# EAGLE design shemLamps (EAGLE 9.6.2)
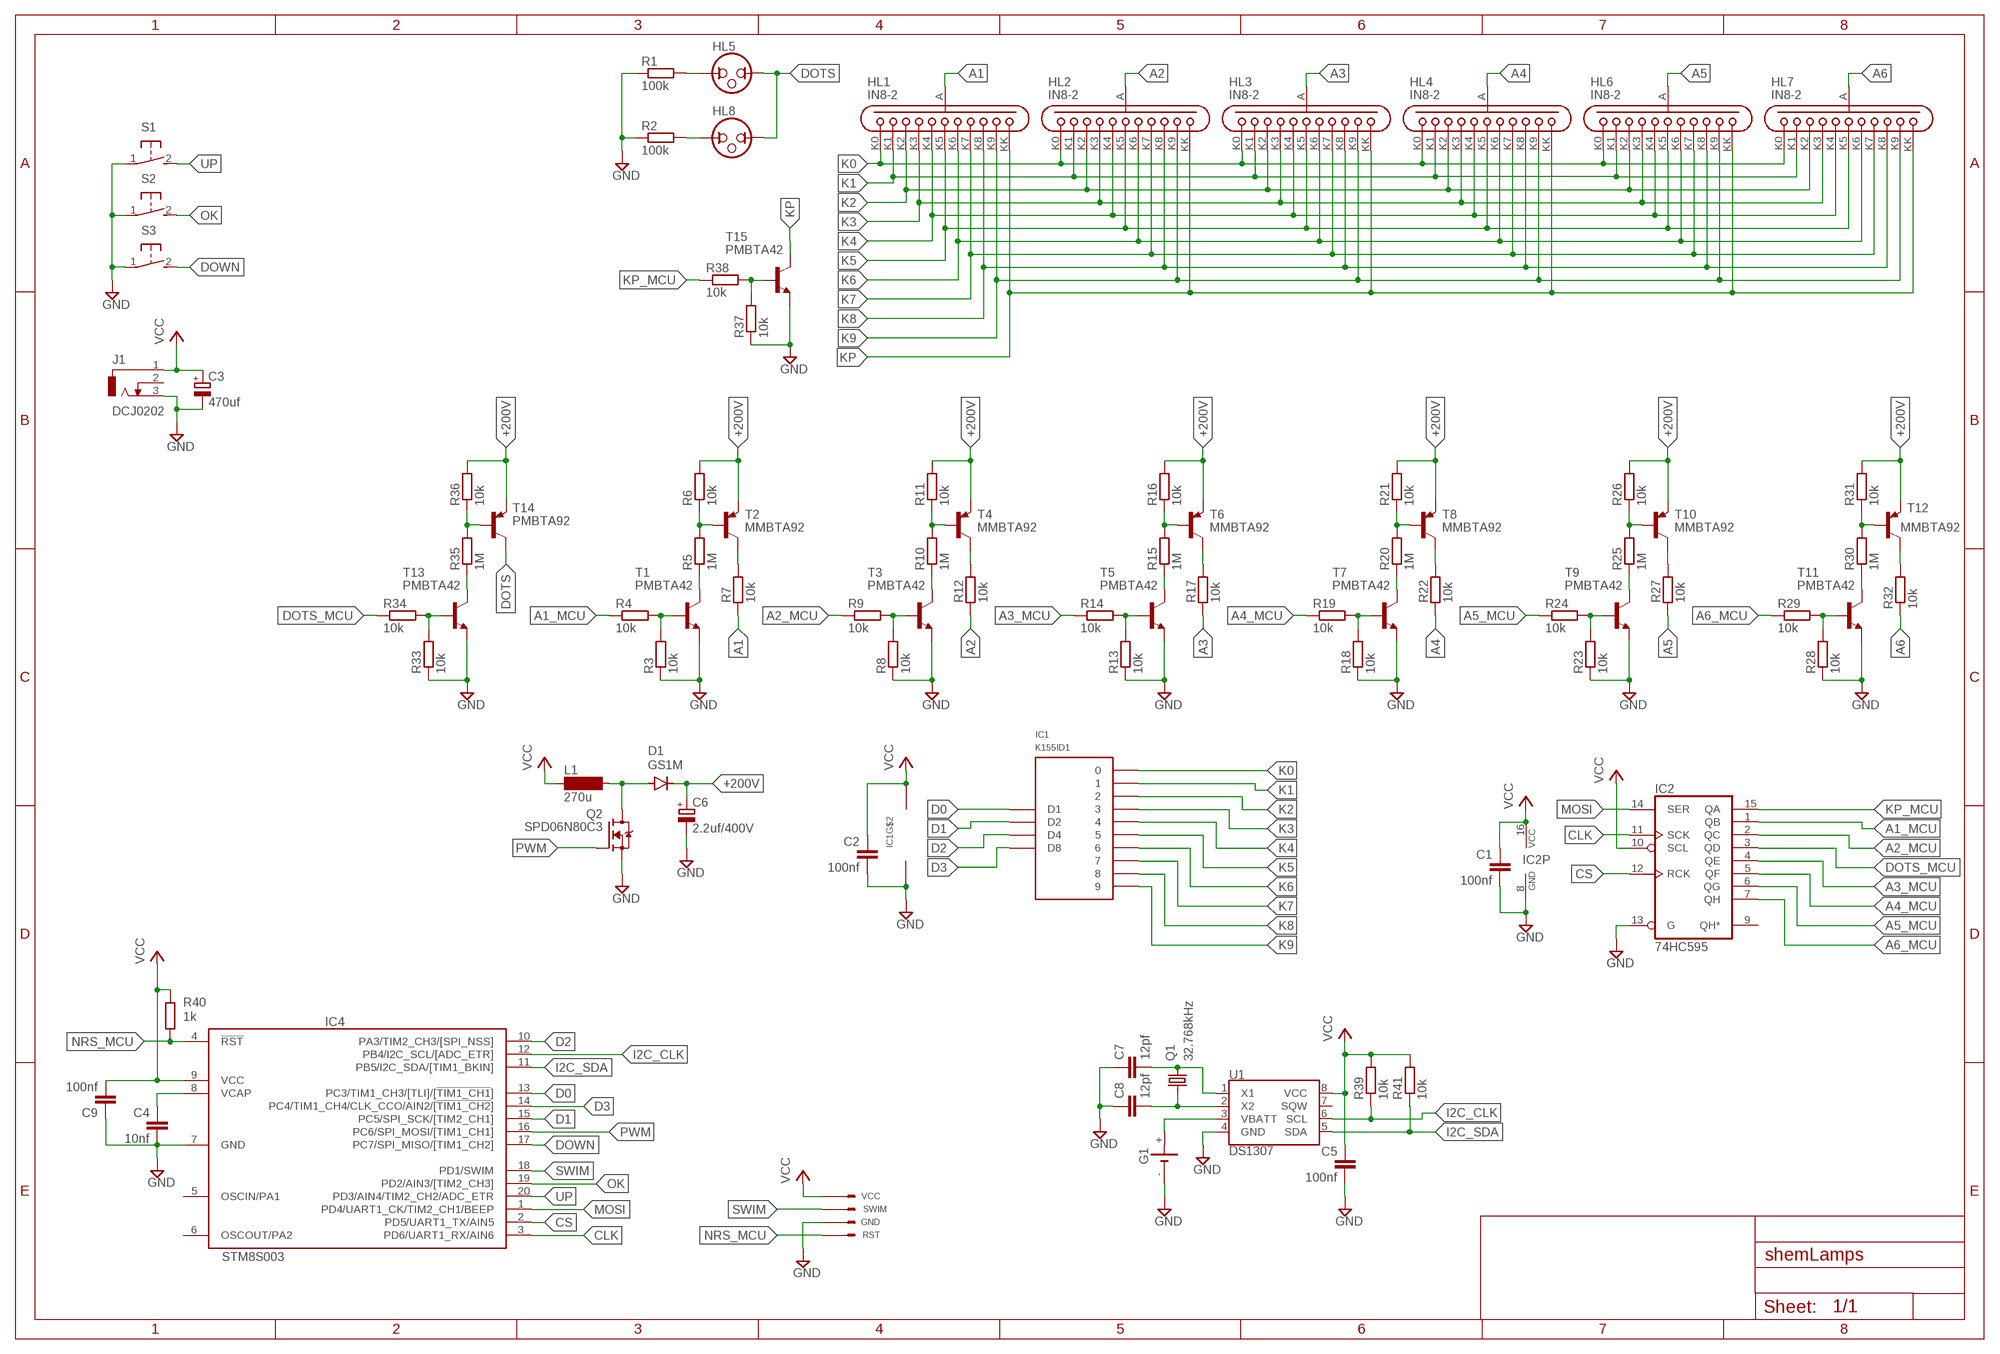
[diagram p0: schematic, sheet 1]

## Parts
C1  100nf  CAP  [C0805]
C2  100nf  CAP  [C0805]
C3  470uf  CPOL-EUE3.5-8  [E3,5-8]
C4  10nf  CAP  [C0805]
C5  100nf  CAP  [C0805]
C6  2.2uf/400V  CPOL-EUE3.5-8  [E3,5-8]
C7  12pf  CAP  [C0805]
C8  12pf  CAP  [C0805]
C9  100nf  CAP  [C0805]
D1  GS1M  DIODE-DO-214AC  [DO-214AC]
G1  BATTERY  [CH291-1220LF_W]
HL1  IN8-2  [IN8-2]
HL2  IN8-2  [IN8-2]
HL3  IN8-2  [IN8-2]
HL4  IN8-2  [IN8-2]
HL5  NEON_LAMP  [NEON_LAMP]
HL6  IN8-2  [IN8-2]
HL7  IN8-2  [IN8-2]
HL8  NEON_LAMP  [NEON_LAMP]
IC1  K155ID1  [DIL16]
IC2  74HC595  [TSSOP16L]
IC4  STM8S003  [TSSOP-20]
J1  DCJ0202  [DCJ0202]
L1  270u  BS11  [BS11]
Q1  32.768kHz  CRYSTALTC26H  [TC26H]
Q2  SPD06N80C3  [TO252]
R1  100k  R-EU_0207/10  [0207/10]
R2  100k  R-EU_0207/10  [0207/10]
R3  10k  RES  [R0805]
R4  10k  RES  [R0805]
R5  1M  RES  [R0805]
R6  10k  RES  [R0805]
R7  10k  RES  [R0805]
R8  10k  RES  [R0805]
R9  10k  RES  [R0805]
R10  1M  RES  [R0805]
R11  10k  RES  [R0805]
R12  10k  RES  [R0805]
R13  10k  RES  [R0805]
R14  10k  RES  [R0805]
R15  1M  RES  [R0805]
R16  10k  RES  [R0805]
R17  10k  RES  [R0805]
R18  10k  RES  [R0805]
R19  10k  RES  [R0805]
R20  1M  RES  [R0805]
R21  10k  RES  [R0805]
R22  10k  RES  [R0805]
R23  10k  RES  [R0805]
R24  10k  RES  [R0805]
R25  1M  RES  [R0805]
R26  10k  RES  [R0805]
R27  10k  RES  [R0805]
R28  10k  RES  [R0805]
R29  10k  RES  [R0805]
R30  1M  RES  [R0805]
R31  10k  RES  [R0805]
R32  10k  RES  [R0805]
R33  10k  RES  [R0805]
R34  10k  RES  [R0805]
R35  1M  RES  [R0805]
R36  10k  RES  [R0805]
R37  10k  RES  [R0805]
R38  10k  RES  [R0805]
R39  10k  RES  [R0805]
R40  1k  RES  [R0805]
R41  10k  RES  [R0805]
S1  31-XX  [B3F-31XX]
S2  31-XX  [B3F-31XX]
S3  31-XX  [B3F-31XX]
SV1  SWIM  [SWIM]
T1  PMBTA42  BC817-16-NPN-SOT23-BEC  [SOT23-BEC]
T2  MMBTA92  BC807-16-PNP-SOT23-BEC  [SOT23-BEC]
T3  PMBTA42  BC817-16-NPN-SOT23-BEC  [SOT23-BEC]
T4  MMBTA92  BC807-16-PNP-SOT23-BEC  [SOT23-BEC]
T5  PMBTA42  BC817-16-NPN-SOT23-BEC  [SOT23-BEC]
T6  MMBTA92  BC807-16-PNP-SOT23-BEC  [SOT23-BEC]
T7  PMBTA42  BC817-16-NPN-SOT23-BEC  [SOT23-BEC]
T8  MMBTA92  BC807-16-PNP-SOT23-BEC  [SOT23-BEC]
T9  PMBTA42  BC817-16-NPN-SOT23-BEC  [SOT23-BEC]
T10  MMBTA92  BC807-16-PNP-SOT23-BEC  [SOT23-BEC]
T11  PMBTA42  BC817-16-NPN-SOT23-BEC  [SOT23-BEC]
T12  MMBTA92  BC807-16-PNP-SOT23-BEC  [SOT23-BEC]
T13  PMBTA42  BC817-16-NPN-SOT23-BEC  [SOT23-BEC]
T14  PMBTA92  BC807-16-PNP-SOT23-BEC  [SOT23-BEC]
T15  PMBTA42  BC817-16-NPN-SOT23-BEC  [SOT23-BEC]
U1  DS1307  [SO08]

## Nets
+200V: C6.+ D1.C R6.2 R11.2 R16.2 R21.2 R26.2 R31.2 R36.2 T2.E T4.E T6.E T8.E T10.E T12.E T14.E
A1: HL1.A R7.1
A1_MCU: IC2.1(QB) R4.1
A2: HL2.A R12.1
A2_MCU: IC2.2(QC) R9.1
A3: HL3.A R17.1
A3_MCU: IC2.4(QE) R14.1
A4: HL4.A R22.1
A4_MCU: IC2.5(QF) R19.1
A5: HL6.A R27.1
A5_MCU: IC2.6(QG) R24.1
A6: HL7.A R32.1
A6_MCU: IC2.7(QH) R29.1
CLK: IC2.11(SCK) IC4.3(PD6/UART1_RX/AIN6)
CS: IC2.12(RCK) IC4.2(PD5/UART1_TX/AIN5)
D0: IC1.3(D1) IC4.13(PC3/TIM1_CH3/[TLI]/[!TIM1_CH1!])
D1: IC1.6(D2) IC4.15(PC5/SPI_SCK/[TIM2_CH1])
D2: IC1.7(D4) IC4.10(PA3/TIM2_CH3/[SPI_NSS])
D3: IC1.4(D8) IC4.14(PC4/TIM1_CH4/CLK_CCO/AIN2/[!TIM1_CH2!])
DOTS: HL5.2 HL8.2 T14.C
DOTS_MCU: IC2.3(QD) R34.1
DOWN: IC4.17(PC7/SPI_MISO/[TIM1_CH2]) S3.2(S)
GND: C1.2 C2.2 C3.- C4.2 C5.2 C6.- C7.1 C8.1 C9.1 G1.- IC1.12(GND) IC2.8(GND) IC2.13(G) IC4.7(GND) J1.3 Q2.2(S) R1.1 R2.1 R3.1 R8.1 R13.1 R18.1 R23.1 R28.1 R33.1 R37.1 S1.1(P) S2.1(P) S3.1(P) SV1.GND T1.E T3.E T5.E T7.E T9.E T11.E T13.E T15.E U1.4(GND)
I2C_CLK: IC4.12(PB4/I2C_SCL/[ADC_ETR]) R39.1 U1.6(SCL)
I2C_SDA: IC4.11(PB5/I2C_SDA/[TIM1_BKIN]) R41.1 U1.5(SDA)
K0: HL1.K0 HL2.K0 HL3.K0 HL4.K0 HL6.K0 HL7.K0 IC1.16
K1: HL1.K1 HL2.K1 HL3.K1 HL4.K1 HL6.K1 HL7.K1 IC1.15
K2: HL1.K2 HL2.K2 HL3.K2 HL4.K2 HL6.K2 HL7.K2 IC1.8
K3: HL1.K3 HL2.K3 HL3.K3 HL4.K3 HL6.K3 HL7.K3 IC1.9
K4: HL1.K4 HL2.K4 HL3.K4 HL4.K4 HL6.K4 HL7.K4 IC1.13
K5: HL1.K5 HL2.K5 HL3.K5 HL4.K5 HL6.K5 HL7.K5 IC1.14
K6: HL1.K6 HL2.K6 HL3.K6 HL4.K6 HL6.K6 HL7.K6 IC1.11
K7: HL1.K7 HL2.K7 HL3.K7 HL4.K7 HL6.K7 HL7.K7 IC1.10
K8: HL1.K8 HL2.K8 HL3.K8 HL4.K8 HL6.K8 HL7.K8 IC1.1
K9: HL1.K9 HL2.K9 HL3.K9 HL4.K9 HL6.K9 HL7.K9 IC1.2
KP: HL1.KK HL2.KK HL3.KK HL4.KK HL6.KK HL7.KK T15.C
KP_MCU: IC2.15(QA) R38.1
MOSI: IC2.14(SER) IC4.1(PD4/UART1_CK/TIM2_CH1/BEEP)
N$1: HL5.1 R1.2
N$2: HL8.1 R2.2
N$3: R3.2 R4.2 T1.B
N$4: R8.2 R9.2 T3.B
N$5: R5.1 T1.C
N$6: R5.2 R6.1 T2.B
N$7: R10.1 T3.C
N$8: R7.2 T2.C
N$9: R10.2 R11.1 T4.B
N$10: R12.2 T4.C
N$11: R13.2 R14.2 T5.B
N$12: R15.1 T5.C
N$13: R15.2 R16.1 T6.B
N$14: R17.2 T6.C
N$15: R18.2 R19.2 T7.B
N$16: R20.1 T7.C
N$17: R20.2 R21.1 T8.B
N$18: R22.2 T8.C
N$19: R23.2 R24.2 T9.B
N$20: R25.1 T9.C
N$21: R25.2 R26.1 T10.B
N$22: R27.2 T10.C
N$23: R28.2 R29.2 T11.B
N$24: R30.1 T11.C
N$25: R30.2 R31.1 T12.B
N$26: R32.2 T12.C
N$27: R37.2 R38.2 T15.B
N$28: D1.A L1.2 Q2.3(D)
N$30: C4.1 IC4.8(VCAP)
N$31: G1.+ U1.3(VBATT)
N$32: C8.2 Q1.2 U1.2(X2)
N$33: R33.2 R34.2 T13.B
N$34: R35.1 T13.C
N$35: R35.2 R36.1 T14.B
N$36: C7.2 Q1.1 U1.1(X1)
NRS_MCU: IC4.4(!RST) R40.1 SV1.NRS(RST)
OK: IC4.19(PD2/AIN3/[TIM2_CH3]) S2.2(S)
PWM: IC4.16(PC6/SPI_MOSI/[TIM1_CH1]) Q2.1(G)
SWIM: IC4.18(PD1/SWIM) SV1.SWIM
UP: IC4.20(PD3/AIN4/TIM2_CH2/ADC_ETR) S1.2(S)
VCC: C1.1 C2.1 C3.+ C5.1 C9.2 IC1.5(VCC) IC2.10(SCL) IC2.16(VCC) IC4.9(VCC) J1.1 L1.1 R39.2 R40.2 R41.2 SV1.VCC U1.8(VCC)
Unconnected: IC2.9(QH*) IC4.5(OSCIN/PA1) IC4.6(OSCOUT/PA2) J1.2 U1.7(SQW)

## Library data of the parts
C1 C2 C4 C5 C7-C9 = myRlc:CAP
C3 C6 = rcl:CPOL-EU: POLARIZED CAPACITOR, European symbol; SPICEPREFIX: C
D1 = diode:DIODE-: DIODE
G1 = clock_7seg_0.8inch:BATTERY
HL1-HL4 HL6 HL7 = LAMPS:IN8-2
HL5 HL8 = LAMPS:NEON_LAMP
IC1 = LAMPS:K155ID1
IC2 = inter:74HC595
IC4 = inter:STM8S003: Value line, 16 MHz STM8S 8-bit MCU, 8 Kbytes Flash, 128 bytes data EEPROM, 10-bit ADC, 3 timers, UART, SPI, I2C
J1 = con-jack:DCJ0202: DC POWER JACK Source: DCJ0202.pdf; OC_FARNELL: unknown; OC_NEWARK: unknown
L1 = inductor-neosid:BS: INDUCTOR nominal inductance, magnetically screened; OC_FARNELL: unknown; OC_NEWARK: unknown
Q1 = crystal:CRYSTAL: CRYSTAL; OC_FARNELL: unknown; OC_NEWARK: unknown
Q2 = inter:SPD06N80C3
R1 R2 = rcl:R-EU_: RESISTOR, European symbol; SPICEPREFIX: R
R3-R41 = myRlc:RES
S1-S3 = switch-omron:31-XX: OMRON SWITCH; MPN: B3F-3100; OC_FARNELL: 959704; OC_NEWARK: 36M3582
SV1 = inter:SWIM
T1 T3 T5 T7 T9 T11 T13 T15 = transistor:*-NPN-: NPN Transistror BF959 corrected 2008.03.06
T2 T4 T6 T8 T10 T12 T14 = transistor:*-PNP-: PNP Transistror
U1 = inter:DS1307: Maxim DS1307 - I2C Real-time clock (RTC) The DS1307 serial real-time clock (RTC) is a low-power, full binary-coded decimal (BCD) clock/calendar plus 56 bytes of NV SRAM. Address and data are transferred serially through an I2C, bidirectional bus. The clock/calendar provides seconds, minutes, hours, day, date, month, and year information. SparkFun Products: Real Time Clock Module <https://www.sparkfun.com/products/12708> (BOB-12708) Datasheet <https://cdn.sparkfun.com/datasheets/BreakoutBoards/DS1307.pdf>

## Board
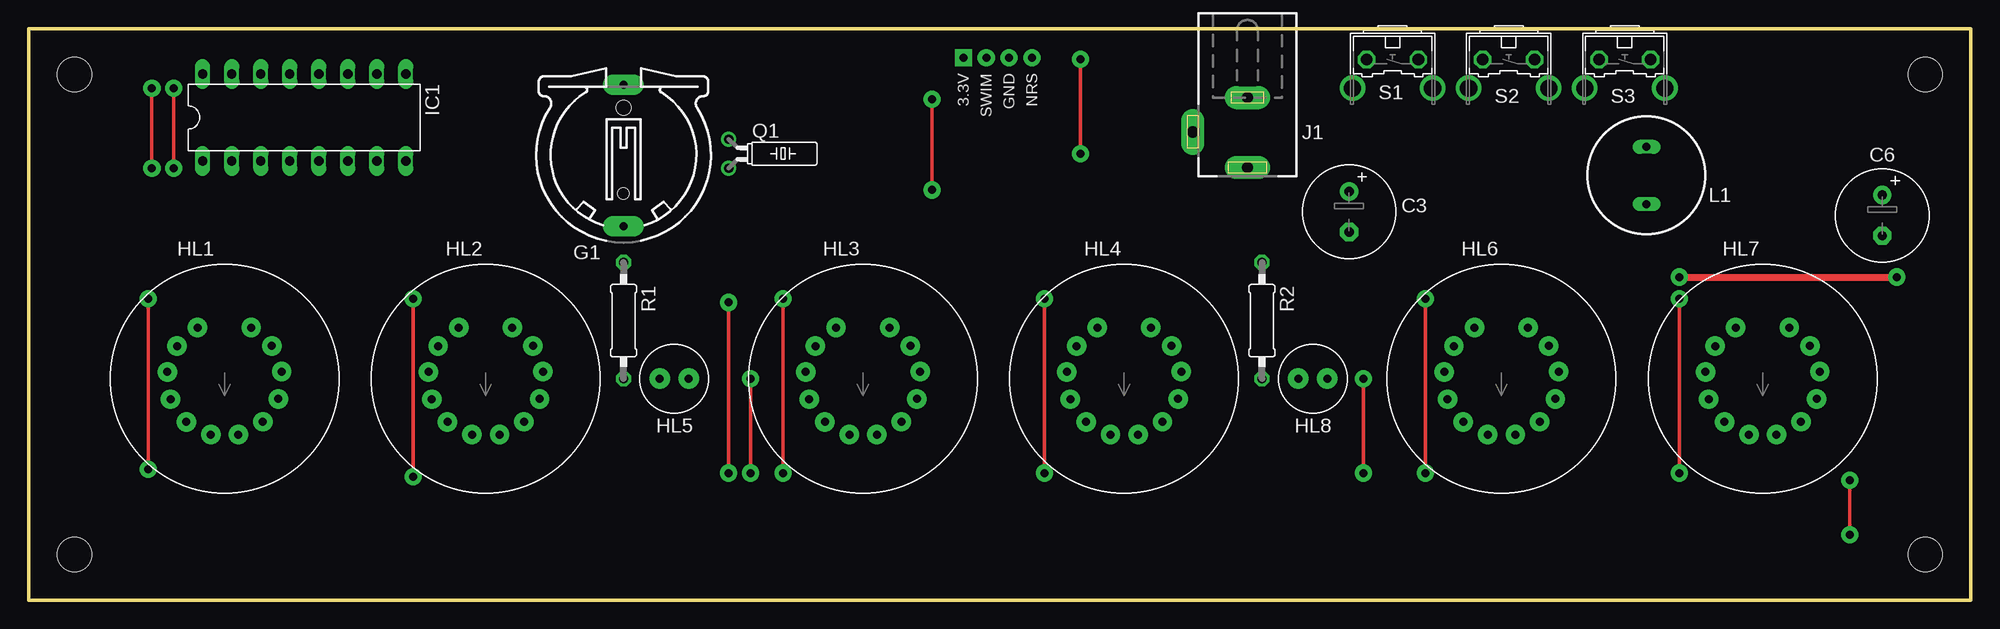
[diagram p1: board, top side]
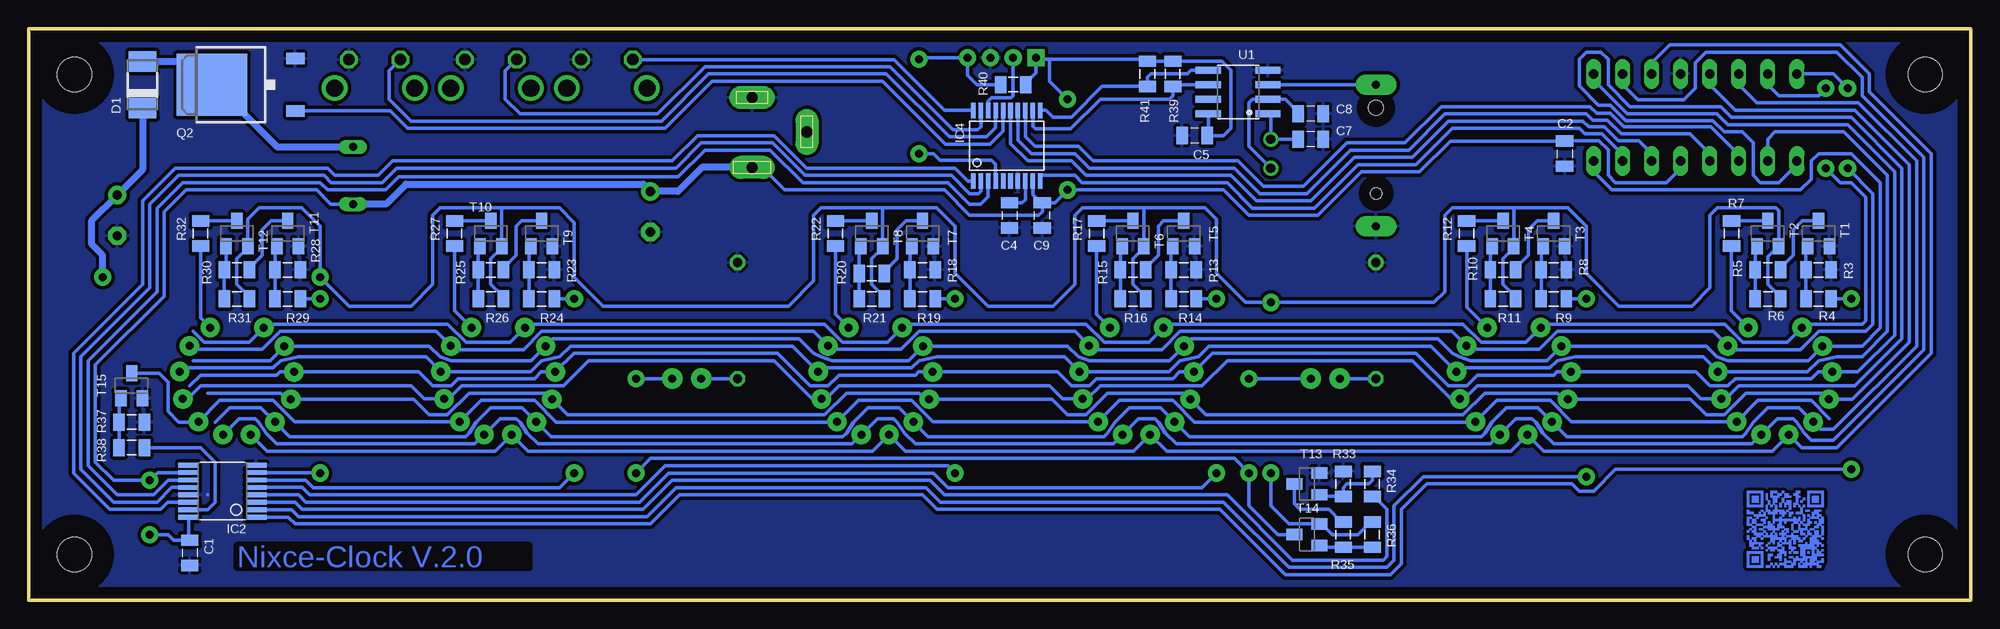
[diagram p2: board, bottom side, seen from below]

Size 170 x 50 mm. Coordinates in mm from the lower left corner, seen from the top.
Outline: 0,0 0,50 170,50 170,0 0,0
Copper layers (1*16): Top 0.035mm / dielectric 1.5mm / Bottom 0.035mm
Design rules "default *": minimum track width 0.3mm, minimum drill 0.7mm, track to track 0.1mm, track to pad 0.1mm, pad to pad 0.1mm, via to via 6mil, smd to smd 6mil, copper to edge 40mil, drill to drill 6mil, minimum pad ring 10mil, minimum via ring 0.4mm, stop-mask expansion 4mil, vias tented up to drill 0mil, thermal gap 10mil
Holes 3 mm at 4,4 4,46 166,4 166,46
bRestrict: area 1,43 to 7,49; area 1,1 to 7,7; area 163,1 to 169,7; area 163,43 to 169,49

### Footprints (pad centres in the part's own frame; a part is rotated, then mirrored left to right if it is on the bottom)
C0805 = smd 1 x 1.5: 1 -1.102,0; 2 1.102,0
E3,5-8 = drill 0.813 pad 1.6: + -1.778,0 | drill 0.813 pad 1.6 octagon: - 1.778,0
DO-214AC = smd 1.8 x 2.4: A 2.025,0; C -2.025,0
CH291-1220LF_W = drill 0.7 pad 1.8 long: + 0,0; - 0,12.383 | hole 1.3: 0,2 | hole 1: 0,9.5
IN8-2 = drill 0.7 pad 1.7: A 2.337,4.47; K0 4.147,2.874; K1 -2.354,4.459; K2 -4.156,2.853; K3 -5.006,0.594; K4 -4.709,-1.802; K5 -3.333,-3.785; K6 -1.192,-4.902; K7 1.222,-4.896; K8 4.723,-1.779; K9 5.009,0.618; KK 3.357,-3.769
NEON_LAMP = drill 0.7 pad 1.8: 1 -1.27,0; 2 1.27,0
DIL16 = drill 0.813 long: 1 -8.89,-3.81; 2 -6.35,-3.81; 3 -3.81,-3.81; 4 -1.27,-3.81; 5 1.27,-3.81; 6 3.81,-3.81; 7 6.35,-3.81; 8 8.89,-3.81; 9 8.89,3.81; 10 6.35,3.81; 11 3.81,3.81; 12 1.27,3.81; 13 -1.27,3.81; 14 -3.81,3.81; 15 -6.35,3.81; 16 -8.89,3.81
TSSOP16L = smd 0.42 x 1.78: 1 -2.275,-2.97; 2 -1.625,-2.97; 3 -0.975,-2.97; 4 -0.325,-2.97; 5 0.325,-2.97; 6 0.975,-2.97; 7 1.625,-2.97; 8 2.275,-2.97; 9 2.275,2.97; 10 1.625,2.97; 11 0.975,2.97; 12 0.325,2.97; 13 -0.325,2.97; 14 -0.975,2.97; 15 -1.625,2.97; 16 -2.275,2.97
TSSOP-20 = smd 0.4 x 1.35: 1 -2.54,-3.04; 2 -1.89,-3.04; 3 -1.24,-3.04; 4 -0.59,-3.04; 5 0.06,-3.04; 6 0.71,-3.04; 7 1.36,-3.04; 8 2.01,-3.04; 9 2.66,-3.04; 10 3.31,-3.04; 11 3.31,3.16; 12 2.66,3.16; 13 2.01,3.16; 14 1.36,3.16; 15 0.71,3.16; 16 0.06,3.16; 17 -0.59,3.16; 18 -1.24,3.16; 19 -1.89,3.16; 20 -2.54,3.16
DCJ0202 = drill 1 pad 2 long: 1 0,3.1; 2 4.8,0; 3 0,-3
BS11 = drill 0.7 long: 1 -2.5,0; 2 2.5,0
TC26H = drill 0.813: 1 -1.27,0; 2 1.27,0
TO252 = smd 1 x 1.6: 1 -2.28,-4.8; 2 2.28,-4.8 | smd 5.4 x 6.2: 3 0,2.5
0207/10 = drill 0.813 octagon: 1 -5.08,0; 2 5.08,0
R0805 = smd 1 x 1.5: 1 -1.102,0; 2 1.102,0
B3F-31XX = drill 1.016 octagon: 1 -2.261,-1.245; 2 2.261,-1.245 | drill 1.499 pad 2.159: 3 -3.505,1.245; 4 3.505,1.245
SWIM = drill 0.7 pad 1.5: GND 0.19,0.73; NRS 0.19,2.73; SWIM 0.19,-1.27 | drill 0.7 pad 1.5 square: VCC 0.19,-3.27
SOT23-BEC = smd 1 x 1.4: B -0.95,-1.1; C 0,1.1; E 0.95,-1.1
SO08 = smd 0.61 x 2.21: 1 -1.905,-2.616; 2 -0.635,-2.616; 3 0.635,-2.616; 4 1.905,-2.616; 5 1.905,2.616; 6 0.635,2.616; 7 -0.635,2.616; 8 -1.905,2.616

### Placement (x,y rotation side)
C1  155.89,4.13 270 bottom
C2  35.56,39.05 270 bottom
C3  115.57,33.97 270 top
C4  84.14,33.66 270 bottom
C5  67.94,40.64 180 bottom
C6  162.24,33.66 270 top
C7  57.78,40.32 180 bottom
C8  57.78,42.55 180 bottom
C9  81.28,33.66 90 bottom
D1  160.02,45.09 90 bottom
G1  52.07,45.09 180 top
HL1  17.14,19.37 0 top
HL2  40.01,19.37 0 top
HL3  73.03,19.37 0 top
HL4  95.89,19.37 0 top
HL5  56.52,19.37 0 top
HL6  128.91,19.37 0 top
HL7  151.76,19.37 0 top
HL8  112.39,19.37 0 top
IC1  24.13,42.23 0 top
IC2  153.03,9.53 90 bottom
IC4  84.77,39.69 0 bottom
J1  106.68,40.96 180 top
L1  141.6,37.15 90 top
Q1  61.28,39.05 270 top
Q2  151.45,45.09 90 bottom
R1  52.07,24.45 270 top
R2  107.95,24.45 270 top
R3  13.34,28.89 180 bottom
R4  13.34,26.35 180 bottom
R5  17.78,28.89 180 bottom
R6  17.78,26.35 0 bottom
R7  20.95,32.07 90 bottom
R8  36.51,28.89 180 bottom
R9  36.51,26.35 180 bottom
R10  40.96,28.89 180 bottom
R11  40.96,26.35 0 bottom
R12  44.13,32.07 90 bottom
R13  68.9,28.89 180 bottom
R14  68.9,26.35 180 bottom
R15  73.34,28.89 180 bottom
R16  73.34,26.35 0 bottom
R17  76.52,32.07 90 bottom
R18  91.76,28.89 180 bottom
R19  91.76,26.35 180 bottom
R20  96.2,28.57 180 bottom
R21  96.2,26.35 0 bottom
R22  99.38,32.07 90 bottom
R23  125.09,28.89 180 bottom
R24  125.09,26.35 180 bottom
R25  129.54,28.89 180 bottom
R26  129.54,26.35 0 bottom
R27  132.72,32.07 90 bottom
R28  147.32,28.89 180 bottom
R29  147.32,26.35 180 bottom
R30  151.76,28.89 180 bottom
R31  151.76,26.35 0 bottom
R32  154.94,32.07 90 bottom
R33  54.93,10.16 270 bottom
R34  52.39,10.16 90 bottom
R35  54.93,5.71 270 bottom
R36  52.39,5.71 90 bottom
R37  160.97,15.56 180 bottom
R38  160.97,13.34 180 bottom
R39  69.85,46.04 90 bottom
R40  83.82,45.09 0 bottom
R41  72.07,46.04 90 bottom
S1  119.38,46.04 180 top
S2  129.54,46.04 180 top
S3  139.7,46.04 180 top
SV1  85.09,47.62 270 top
T1  13.34,32.07 0 bottom
T2  17.78,32.07 0 bottom
T3  36.51,32.07 0 bottom
T4  40.96,32.07 0 bottom
T5  68.9,32.07 0 bottom
T6  73.34,32.07 0 bottom
T7  91.76,32.07 0 bottom
T8  96.2,32.07 0 bottom
T9  125.09,32.07 0 bottom
T10  129.54,32.07 0 bottom
T11  147.32,32.07 0 bottom
T12  151.76,32.07 0 bottom
T13  58.1,10.16 90 bottom
T14  58.1,5.71 90 bottom
T15  160.97,18.73 0 bottom
U1  64.14,44.45 90 bottom

### Tracks (layer width: path | path; a pad name or v marks a point on that pad's centre or on a via)
+200V  (via drill 0.7)
  Top 0.3: v61.28,26.04 v61.28,11.11
  Top 0.6: v144.46,28.26 v163.51,28.26
  Bottom 0.3: R6.2 16.68,26.52 17.78,27.62 17.78,30.02 T2.E 16.83,34.05 17.09,34.32 22.2,34.32 22.86,33.66 22.86,27.3 24.45,25.72 30.8,25.72 33.66,28.57 33.66,32.7 35.27,34.32 40.01,34.32 | R11.2 39.85,26.52 40.96,27.62 40.96,29.84 40.01,30.8 T4.E 40.01,34.31 40.01,34.32 | R16.2 72.24,26.52 73.34,27.62 73.34,29.84 72.39,30.8 T6.E 72.39,34.31 72.39,34.32 | R21.2 95.1,26.52 96.2,27.62 96.2,29.84 95.25,30.8 T8.E 95.25,34.32 | 72.39,34.32 77.76,34.32 78.42,33.66 78.42,27.62 80.33,25.72 86.04,25.72 88.9,28.57 88.9,32.7 90.52,34.32 95.25,34.32 | 72.39,34.32 67.02,34.32 66.04,33.34 66.04,28.57 63.5,26.04 v61.28,26.04 46.99,26.04 46.04,26.99 46.04,33.66 45.38,34.32 40.01,34.32 | R26.2 128.44,26.52 129.54,27.62 129.54,29.84 128.59,30.8 T10.E 128.59,34.32 | 128.59,34.32 123.53,34.32 122.24,33.02 122.24,28.26 119.7,25.72 103.5,25.72 101.28,27.94 101.28,33.66 100.62,34.32 95.25,34.32 | R31.2 150.66,26.52 151.76,27.62 151.76,29.84 150.81,30.8 T12.E 150.81,33.34 149.83,34.32 146.08,34.32 144.46,32.7 v144.46,28.26 141.92,25.72 136.53,25.72 134.62,27.62 134.62,33.66 133.96,34.32 128.59,34.32 | R36.2 52.55,6.82 53.66,5.71 55.88,5.71 56.83,6.67 T14.E 59.69,6.67 61.28,8.26 v61.28,11.11
  Bottom 0.6: v163.51,28.26 163.51,30.16 164.47,31.11 164.47,33.21 C6.+ 160.02,37.66 D1.C
A1
  Bottom 0.3: HL1.A 20.95,25.31 R7.1
A1_MCU  (via drill 0.7)
  Top 0.3: v10.48,26.35 v10.48,11.43
  Bottom 0.3: R4.1 v10.48,26.35 | v10.48,11.43 31.11,11.43 33.02,9.53 34.29,9.53 34.92,10.16 47.62,10.16 49.85,7.94 49.85,3.17 50.8,2.22 60.01,2.22 65.72,7.94 90.49,7.94 91.76,9.21 113.03,9.21 115.57,6.67 146.69,6.67 147.27,7.25 IC2.1
A2
  Bottom 0.3: HL2.A 44.13,25.63 R12.1
A2_MCU  (via drill 0.7)
  Top 0.3: v33.66,26.35 v33.66,10.79
  Bottom 0.3: R9.1 v33.66,26.35 | v33.66,10.79 47.94,10.79 50.48,8.26 50.48,3.49 51.12,2.86 59.69,2.86 65.41,8.57 90.17,8.57 91.44,9.84 113.35,9.84 115.89,7.3 146.37,7.3 146.97,7.9 IC2.2
A3
  Bottom 0.3: R17.1 76.52,24.99 HL3.A
A3_MCU  (via drill 0.7)
  Top 0.3: v66.04,26.35 v66.04,11.11
  Bottom 0.3: R14.1 v66.04,26.35 | IC2.4 146.36,9.2 145.73,8.57 116.52,8.57 113.98,11.11 90.81,11.11 89.53,9.84 67.31,9.84 v66.04,11.11
A4
  Bottom 0.3: HL4.A 99.38,24.99 R22.1
A4_MCU  (via drill 0.7)
  Top 0.3: v88.9,26.35 v88.9,11.11
  Bottom 0.3: R19.1 v88.9,26.35 | IC2.5 146.06,9.85 145.41,9.21 116.84,9.21 114.3,11.75 89.53,11.75 v88.9,11.11
A5
  Bottom 0.3: HL6.A 132.72,25.31 R27.1
A5_MCU  (via drill 0.7)
  Top 0.3: v122.24,26.35 v122.24,11.11
  Bottom 0.3: R24.1 v122.24,26.35 | IC2.6 145.75,10.5 145.1,9.84 123.51,9.84 v122.24,11.11
A6
  Bottom 0.3: R32.1 154.94,24.68 HL7.A
A6_MCU  (via drill 0.7)
  Top 0.3: v144.46,26.35 v144.46,11.11
  Bottom 0.3: R29.1 v144.46,26.35 | IC2.7 144.5,11.15 v144.46,11.11
CLK
  Bottom 0.3: IC2.11 157.78,10.5 159.07,9.21 162.24,9.21 164.78,11.75 164.78,20.95 158.75,26.99 158.75,34.29 156.53,36.51 144.46,36.51 143.83,35.88 138.75,35.88 137.59,37.03 113.14,37.03 110.81,39.37 105.09,39.37 102.23,36.51 89.53,36.51 87.63,34.61 86.68,34.61 86.01,35.27 IC4.3
CS
  Bottom 0.3: IC2.12 157.47,9.85 158.75,8.57 162.56,8.57 165.42,11.43 165.42,21.27 159.38,27.3 159.38,34.61 156.84,37.15 144.15,37.15 143.51,36.51 139.06,36.51 137.79,37.78 113.35,37.78 111.12,40.01 104.89,40.01 102.04,37.15 89.22,37.15 87.63,35.56 86.87,35.56 86.66,35.77 IC4.2
D0
  Bottom 0.3: IC1.3 20.32,38.95 22.76,41.39 30.37,41.39 31.57,42.59 32.75,42.59 33.34,43.18 46.35,43.18 49.53,40.01 54.61,40.01 58.42,36.2 61.91,36.2 64.14,38.42 76.83,38.42 78.11,39.69 81.92,39.69 82.76,40.53 IC4.13
D1
  Bottom 0.3: IC1.6 27.94,39.05 29.08,40.19 30.86,40.19 32.06,41.39 33.45,41.39 33.97,41.91 45.72,41.91 48.9,38.73 53.98,38.73 57.78,34.92 62.55,34.92 64.77,37.15 77.47,37.15 78.74,38.42 82.55,38.42 84.06,39.93 IC4.15
D2
  Bottom 0.3: IC1.7 30.48,38.96 32.31,40.79 33.8,40.79 34.29,41.27 45.4,41.27 48.58,38.1 53.66,38.1 57.47,34.29 62.87,34.29 65.09,36.51 77.79,36.51 78.42,37.15 81.46,37.15 IC4.10
D3
  Bottom 0.3: IC1.4 22.86,39.05 24.6,40.79 30.61,40.79 31.81,41.99 33.1,41.99 33.66,42.55 46.04,42.55 49.21,39.37 54.29,39.37 58.1,35.56 62.23,35.56 64.45,37.78 77.15,37.78 78.42,39.05 82.23,39.05 83.41,40.23 IC4.14
DOTS  (via drill 0.7)
  Top 0.3: v116.84,11.11 v116.84,19.37 | v63.18,19.37 v63.18,11.11
  Bottom 0.3: v116.84,19.37 HL8.2 | v116.84,11.11 115.57,12.38 64.45,12.38 v63.18,11.11 63.18,8.26 60.64,5.71 T14.C | HL5.2 v63.18,19.37
DOTS_MCU
  Bottom 0.3: R34.1 52.24,9.06 51.12,7.94 51.12,3.81 51.44,3.49 59.37,3.49 65.09,9.21 89.85,9.21 91.12,10.48 113.67,10.48 116.2,7.94 146.05,7.94 146.66,8.55 IC2.3
DOWN
  Bottom 0.3: IC4.17 85.36,41.32 86.17,40.51 89.41,40.51 94.93,46.04 110.49,46.04 114.62,41.91 136.53,41.91 138.43,43.81 138.43,46.29 S3.2
GND
  Bottom 0.3: 154.31,9.2 154.31,9.21
  pour Bottom (isolate 0.3): 0,0 170,0 170,50 0,50
I2C_CLK
  Bottom 0.3: IC4.12 82.11,41.47 81.86,41.22 78.79,41.22 76.2,43.81 70.17,43.81 69.85,44.13 R39.1 69.7,45.09 U1.6
I2C_SDA
  Bottom 0.3: U1.5 68.26,46.35 68.58,46.04 71.75,46.04 72.07,45.72 R41.1 76.03,44.94 78.74,42.23 80.33,42.23 80.95,42.85 IC4.11
K0  (via drill 0.7)
  Top 0.3: v10.79,37.78 v10.79,44.77
  Bottom 0.3: HL7.K0 155.59,21.92 149.54,21.92 147.97,23.5 134.31,23.5 HL6.K0 132.72,21.91 126.68,21.91 125.09,23.5 101.29,23.5 HL4.K0 99.72,21.92 93.66,21.92 92.08,23.5 78.43,23.5 HL3.K0 76.84,21.91 70.8,21.91 69.22,23.5 45.41,23.5 HL2.K0 43.84,21.92 37.78,21.92 36.2,23.5 22.55,23.5 HL1.K0 20.96,21.91 14.92,21.91 13.34,23.5 9.21,23.5 8.57,24.13 8.57,35.56 v10.79,37.78 | v10.79,44.77 12.06,46.04 IC1.16
K1  (via drill 0.7)
  Top 0.3: v12.7,44.77 v12.7,37.78
  Bottom 0.3: 155.57,23.5 154.62,22.54 150.69,22.54 HL7.K1 149.11,24.13 133.31,24.13 131.72,22.54 127.83,22.54 HL6.K1 126.25,24.13 100.33,24.13 98.74,22.54 94.81,22.54 HL4.K1 93.23,24.13 77.43,24.13 75.84,22.54 71.95,22.54 HL3.K1 70.37,24.13 44.45,24.13 42.86,22.54 38.94,22.54 HL2.K1 37.35,24.13 21.55,24.13 19.96,22.54 16.07,22.54 HL1.K1 14.49,24.13 9.53,24.13 9.21,24.45 9.21,35.24 10.48,36.51 11.43,36.51 v12.7,37.78 | v12.7,44.77 13.34,44.13 16.83,44.13 17.78,45.09 IC1.15
K2
  Bottom 0.3: 155.57,20.95 148.87,20.95 HL7.K2 134.93,22.22 133.99,21.27 133.03,20.95 126.01,20.95 HL6.K2 124.11,22.86 102.55,22.86 101.28,21.59 100.65,21.27 99.69,20.95 92.99,20.95 HL4.K2 79.05,22.22 78.11,21.27 77.15,20.95 70.13,20.95 HL3.K2 68.23,22.86 46.67,22.86 45.4,21.59 44.77,21.27 43.81,20.95 37.11,20.95 HL2.K2 23.17,22.22 22.23,21.27 21.27,20.95 14.25,20.95 HL1.K2 12.68,22.22 12.68,22.23 9.53,22.23 7.94,23.81 7.94,36.51 10.48,39.05 13.34,39.05 13.97,38.42 13.97,36.83 14.92,35.88 31.43,35.88 33.02,37.47 IC1.8
K3
  Bottom 0.3: 155.89,18.73 154.94,19.68 148.27,19.68 148,19.96 HL7.K3 135.85,19.96 134.62,18.73 133.03,18.73 132.4,19.37 125.73,19.37 125.14,19.96 HL6.K3 122.27,21.59 104.46,21.59 101.6,18.73 100.01,18.73 99.06,19.68 92.39,19.68 92.12,19.96 HL4.K3 79.97,19.96 78.74,18.73 77.15,18.73 76.52,19.37 69.85,19.37 69.26,19.96 HL3.K3 66.39,21.59 48.58,21.59 45.72,18.73 44.13,18.73 43.18,19.68 36.51,19.68 36.24,19.96 HL2.K3 24.09,19.96 22.86,18.73 21.27,18.73 20.64,19.37 13.97,19.37 13.38,19.96 HL1.K3 9.88,19.96 6.67,23.18 6.67,37.47 10.79,41.59 21.27,41.59 22.23,42.55 30.07,42.55 33.02,45.5 IC1.9
K4
  Bottom 0.3: 154.31,18.1 147.96,18.1 147.42,17.57 HL7.K4 136.31,17.57 134.94,16.19 133.35,16.19 131.44,18.1 124.73,18.1 HL6.K4 122.82,16.19 100.33,16.19 98.42,18.1 92.08,18.1 91.54,17.57 HL4.K4 80.43,17.57 79.06,16.19 77.47,16.19 75.56,18.1 68.85,18.1 HL3.K4 66.94,16.19 44.45,16.19 42.55,18.1 36.2,18.1 35.66,17.57 HL2.K4 24.55,17.57 23.18,16.19 21.59,16.19 19.68,18.1 12.97,18.1 HL1.K4 10.38,17.57 5.4,22.54 5.4,38.1 10.16,42.86 20.64,42.86 22.86,45.09 IC1.13
K5
  Bottom 0.3: 153.67,15.56 152.4,16.83 149.68,16.83 HL7.K5 147.14,14.29 131.76,14.29 131.44,14.61 130.81,15.56 129.54,16.83 126.82,16.83 HL6.K5 124.28,14.29 98.74,14.29 98.42,14.61 97.79,15.56 96.52,16.83 93.8,16.83 HL4.K5 91.26,14.29 75.88,14.29 75.56,14.61 74.93,15.56 73.66,16.83 70.94,16.83 HL3.K5 68.4,14.29 42.86,14.29 42.55,14.61 41.91,15.56 40.64,16.83 37.92,16.83 HL2.K5 35.38,14.29 20,14.29 19.68,14.61 19.05,15.56 17.78,16.83 15.06,16.83 HL1.K5 13.15,14.92 12.06,14.92 4.76,22.23 4.76,38.42 9.84,43.5 18.73,43.5 20.32,45.09 IC1.14
K6
  Bottom 0.3: HL7.K6 149.12,13.02 129.16,13.02 HL6.K6 126.27,13.02 96.14,13.02 HL4.K6 93.25,13.02 73.28,13.02 HL3.K6 70.39,13.02 40.26,13.02 HL2.K6 37.37,13.02 17.4,13.02 HL1.K6 14.82,13.34 11.75,13.34 3.49,21.59 3.49,39.05 8.89,44.45 8.89,46.04 11.43,48.58 26.35,48.58 27.94,46.99 IC1.11
K7
  Bottom 0.3: HL7.K7 151.58,15.88 150.18,15.88 149.86,15.56 149.22,14.61 148.27,13.65 130.95,13.65 HL6.K7 128.72,15.88 127.32,15.88 127,15.56 126.36,14.61 125.41,13.65 97.93,13.65 HL4.K7 95.7,15.88 94.3,15.88 93.98,15.56 93.34,14.61 92.39,13.65 75.07,13.65 HL3.K7 72.84,15.88 71.44,15.88 71.12,15.56 70.48,14.61 69.53,13.65 42.05,13.65 HL2.K7 39.82,15.88 38.42,15.88 38.1,15.56 37.47,14.61 36.51,13.65 19.19,13.65 HL1.K7 16.96,15.88 15.56,15.88 15.24,15.56 14.61,14.61 13.97,13.97 12.06,13.97 4.13,21.91 4.13,38.73 9.53,44.13 9.53,45.72 11.75,47.94 23.19,47.94 23.97,47.16 23.97,47.15 24.13,46.99 24.13,44.77 25.15,43.75 29.15,43.75 30.48,45.09 IC1.10
K8
  Bottom 0.3: HL7.K8 156.08,17.59 154.94,18.73 136.53,18.73 135.38,17.59 HL6.K8 133.22,17.59 132.08,18.73 123.19,18.73 120.97,20.95 104.78,20.95 101.41,17.59 HL4.K8 100.2,17.59 99.06,18.73 80.64,18.73 79.5,17.59 HL3.K8 77.34,17.59 76.2,18.73 67.31,18.73 65.09,20.95 48.9,20.95 45.53,17.59 HL2.K8 44.32,17.59 43.18,18.73 24.77,18.73 23.62,17.59 HL1.K8 21.46,17.59 20.32,18.73 10.16,18.73 6.03,22.86 6.03,37.78 10.48,42.23 20.95,42.23 21.91,43.18 29.85,43.18 31.75,45.08 31.75,47.31 32.38,47.94 33.66,47.94 34.29,47.31 34.29,44.98 32.6,43.29 31.54,43.29 30.2,41.95 22.58,41.95 21.59,40.96 20,40.96 19.05,40.01 19.05,37.15 18.41,36.51 16.83,36.51 15.24,38.1 IC1.1
K9
  Bottom 0.3: HL7.K9 156.46,20.3 148.61,20.3 147.96,20.95 146.37,21.27 135.2,21.27 HL6.K9 126.06,19.99 125.09,20.95 123.51,21.27 122.56,22.23 103.13,22.23 HL4.K9 100.58,20.3 92.73,20.3 92.08,20.95 90.49,21.27 79.32,21.27 HL3.K9 70.18,19.99 69.22,20.95 67.63,21.27 66.67,22.23 47.25,22.23 HL2.K9 44.7,20.3 36.85,20.3 36.2,20.95 34.61,21.27 23.44,21.27 HL1.K9 14.3,19.99 13.34,20.95 11.75,21.27 9.53,21.27 7.3,23.5 7.3,37.15 11.11,40.96 17.14,40.96 17.78,40.32 IC1.2
KP
  Bottom 0.3: 12.38,15.88 13.97,17.46 18.64,17.46 HL1.KK 34.97,15.6 36.83,17.46 41.5,17.46 HL2.KK 43.4,15.56 67.94,15.56 69.85,17.46 74.52,17.46 HL3.KK 90.85,15.6 92.71,17.46 97.38,17.46 HL4.KK 99.28,15.56 123.83,15.56 125.73,17.46 130.4,17.46 HL6.KK 146.73,15.6 148.59,17.46 153.26,17.46 HL7.KK 155.16,15.56 156.84,15.56 157.8,16.51 157.8,19.05 158.58,19.83 T15.C
KP_MCU
  Bottom 0.3: IC2.15 154.34,7.9 153.67,8.57 153.67,12.06 154.94,13.34 R38.1
MOSI
  Bottom 0.3: IC2.14 157.82,8.55 158.43,7.94 162.88,7.94 166.05,11.11 166.05,21.59 160.02,27.62 160.02,34.92 157.16,37.78 143.83,37.78 143.19,37.15 139.38,37.15 138.11,38.42 113.67,38.42 111.44,40.64 104.78,40.64 101.92,37.78 88.9,37.78 87.77,36.65 IC4.1
N$1
  Bottom 0.3: R1.2 HL5.1
N$2
  Bottom 0.3: R2.2 HL8.1
N$3
  Bottom 0.3: R4.2 R3.2 14.44,30.82 T1.B
N$4
  Bottom 0.3: R9.2 R8.2 37.62,30.82 T3.B
N$5
  Bottom 0.3: R5.1 16.68,29.04 15.56,30.16 15.56,32.38 14.78,33.17 T1.C
N$6
  Bottom 0.3: T2.B 18.88,30.82 R5.2 R6.1
N$7
  Bottom 0.3: R10.1 39.85,29.04 38.73,30.16 38.73,32.38 37.95,33.17 T3.C
N$8
  Bottom 0.3: R7.2 T2.C
N$9
  Bottom 0.3: R11.1 R10.2 42.06,30.82 T4.B
N$10
  Bottom 0.3: R12.2 T4.C
N$11
  Bottom 0.3: R14.2 R13.2 70,30.97 T5.B
N$12
  Bottom 0.3: R15.1 72.24,29.04 71.12,30.16 71.12,32.7 70.66,33.17 T5.C
N$13
  Bottom 0.3: R16.1 R15.2 74.44,30.97 T6.B
N$14
  Bottom 0.3: R17.2 T6.C
N$15
  Bottom 0.3: R19.2 R18.2 92.86,30.97 T7.B
N$16
  Bottom 0.3: R20.1 95.1,28.73 93.98,29.84 93.98,32.38 93.2,33.17 T7.C
N$17
  Bottom 0.3: R21.1 R20.2 97.31,30.97 T8.B
N$18
  Bottom 0.3: R22.2 T8.C
N$19
  Bottom 0.3: R24.2 R23.2 126.2,30.82 T9.B
N$20
  Bottom 0.3: R25.1 128.44,29.04 127.32,30.16 127.32,32.7 126.85,33.17 T9.C
N$21
  Bottom 0.3: R26.1 R25.2 130.64,30.82 T10.B
N$22
  Bottom 0.3: R27.2 T10.C
N$23
  Bottom 0.3: R29.2 R28.2 148.42,30.82 T11.B
N$24
  Bottom 0.3: R30.1 150.66,29.04 149.54,30.16 149.54,32.38 148.76,33.17 T11.C
N$25
  Bottom 0.3: R31.1 R30.2 152.72,29.05 T12.B
N$26
  Bottom 0.3: R32.2 T12.C
N$27
  Bottom 0.3: R38.2 R37.2 162.07,17.48 T15.B
N$28
  Bottom 0.6: 159.5,47.11 D1.A 155.97,47.11 Q2.3 153.67,45.09 148.23,39.65 L1.2
N$30
  Bottom 0.3: IC4.8 82.76,35.03 83.03,34.76 C4.1
N$31
  Bottom 0.3: G1.+ U1.3
N$32
  Bottom 0.3: Q1.2 63.18,39.69 63.18,43.5 62.87,43.81 U1.2 60.01,43.81 58.89,42.7 C8.2
N$33
  Bottom 0.3: T13.B 56.85,9.06 R33.2 54.93,9.84 54.61,10.16 52.7,10.16 52.39,10.48 R34.2
N$34
  Bottom 0.3: R35.1 55.08,6.82 56.2,7.94 58.74,7.94 59.2,8.4 T13.C
N$35
  Bottom 0.3: R36.1 R35.2 56.85,4.61 T14.B
N$36
  Bottom 0.3: U1.1 61.28,42.3 Q1.1 C7.2
NRS_MCU  (via drill 0.7)
  Top 0.3: v92.08,47.31 v92.08,39.05
  Bottom 0.3: v92.08,47.31 91.95,47.44 SV1.NRS 87.82,45.91 87,45.09 R40.1 | IC4.4 85.36,38.12 85.72,38.48 90.23,38.48 90.81,39.05 v92.08,39.05
OK
  Bottom 0.3: IC4.19 86.66,41.42 86.93,41.15 89.09,41.15 94.61,46.67 110.81,46.67 114.94,42.55 127,42.55 128.27,43.81 128.27,46.29 S2.2
PWM
  Bottom 0.3: IC4.16 84.71,41.02 85.85,39.88 89.72,39.88 95.25,45.4 105.07,45.4 105.08,45.41 110.17,45.41 114.3,41.27 136.84,41.27 138.37,42.8 Q2.1
SWIM
  Bottom 0.3: IC4.18 86.01,43.65 85.72,43.94 84.01,43.94 83.82,44.13 SV1.SWIM
UP
  Bottom 0.3: S1.2 94.27,47.28 89.84,42.85 IC4.20
VCC  (via drill 0.7)
  Top 0.3: v159.38,10.48 v159.38,5.71 | v79.06,35.88 v79.06,43.81
  Bottom 0.3: IC2.10 158.71,11.15 v159.38,10.48 162.56,10.48 164.15,12.06 164.15,20.57 158.12,26.6 158.12,33.97 156.21,35.88 144.78,35.88 143.55,34.65 L1.1 | 156.06,7.3 IC2.16 156,5.34 C1.1 157.31,5.23 157.8,5.71 v159.38,5.71 | IC1.5 25.4,37.78 26.67,36.51 31.11,36.51 31.75,37.15 31.75,39.38 32.56,40.19 35.53,40.19 C2.1 | 35.52,40.2 C2.1 | R40.2 82.72,45.23 81.82,46.13 SV1.VCC 81.69,47.31 80.64,47.31 | J1.1 105.8,37.86 103.82,35.88 89.85,35.88 87.63,33.66 81.6,33.66 81.28,33.97 C9.2 | U1.8 66.75,40.73 C5.1 65.41,40.64 64.77,41.27 64.77,46.35 65.56,47.14 R39.2 R41.2 72.24,47.31 80.64,47.31 | v79.06,43.81 80.64,45.4 80.64,47.31 | C2.1 45.57,40.16 48.26,37.47 53.34,37.47 57.15,33.66 63.18,33.66 65.41,35.88 v79.06,35.88 80.18,34.76 C9.2 | C9.2 81.43,34.76 82.11,35.44 IC4.9
  Bottom 0.6: J1.1 111.05,37.86 113.16,35.75 C3.+ 116.2,36.39 136.97,36.39 138.71,34.65 L1.1
(copper drawn outside any net)
  shapes: Bottom area x2248

### Text on the board
Bottom: Nixce-Clock V.2.0